# EAGLE design IOT-Tower-Light-Rev-A (EAGLE 7.5.0)
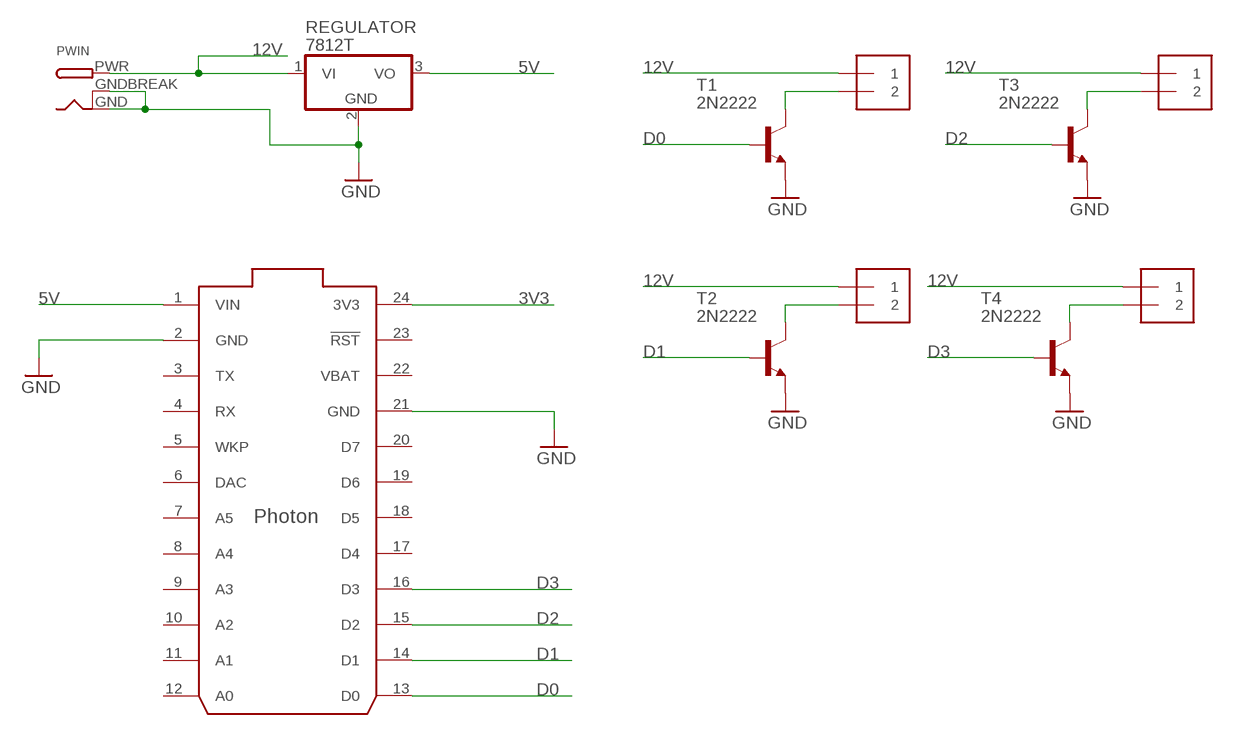
[diagram p0: schematic, sheet 1]

## Parts
BUZZER  1X2-3.5MM  [1X2-3.5MM]
GREEN  1X2-3.5MM  [1X2-3.5MM]
PWIN  DCBARRELPTH  [DCJACK_2MM_PTH]
RED  1X2-3.5MM  [1X2-3.5MM]
REGULATOR  7812T  [TO220H]
T1  2N2222  [TO92-EBC-OVAL]
T2  2N2222  [TO92-EBC-OVAL]
T3  2N2222  [TO92-EBC-OVAL]
T4  2N2222  [TO92-EBC-OVAL]
U$1  PHOTON_WITH_HEADERS  [PHOTON]
YELLOW  1X2-3.5MM  [1X2-3.5MM]

## Nets
3V3: U$1.24(3V3)
5V: REGULATOR.3(VO) U$1.1(VIN)
12V: BUZZER.1 GREEN.1 PWIN.PWR RED.1 REGULATOR.1(VI) YELLOW.1
D0: T1.B U$1.13(D0)
D1: T2.B U$1.14(D1)
D2: T3.B U$1.15(D2)
D3: T4.B U$1.16(D3)
GND: PWIN.GND PWIN.GNDBREAK REGULATOR.2(GND) T1.E T2.E T3.E T4.E U$1.2(GND) U$1.21(GND)
N$1: T2.C YELLOW.2
N$2: RED.2 T1.C
N$3: BUZZER.2 T4.C
N$4: GREEN.2 T3.C
Unconnected: U$1.3(TX) U$1.4(RX) U$1.5(WKP) U$1.6(DAC) U$1.7(A5) U$1.8(A4) U$1.9(A3) U$1.10(A2) U$1.11(A1) U$1.12(A0) U$1.17(D4) U$1.18(D5) U$1.19(D6) U$1.20(D7) U$1.23(!RST)

## Power pins joined to a net without a drawn wire
VBAT: U$1.22(VBAT)

## Library data of the parts
BUZZER GREEN RED YELLOW = adafruit:1X2: 3.5mm Terminal block http://www.ladyada.net/library/pcb/eaglelibrary.html
PWIN = adafruit:DCBARREL: 2.0mm DC Barrel Jack DCJACK_2MM_PTH - Through Hole Jack (4UConnector: 05537)
REGULATOR = adafruit:78*: Positive VOLTAGE REGULATOR Added bigger pads to the TO-92 package
T1-T4 = adafruit:2N2222: NPN TRANSISTOR Big oval pads
U$1 = Spark:PHOTON

## Board
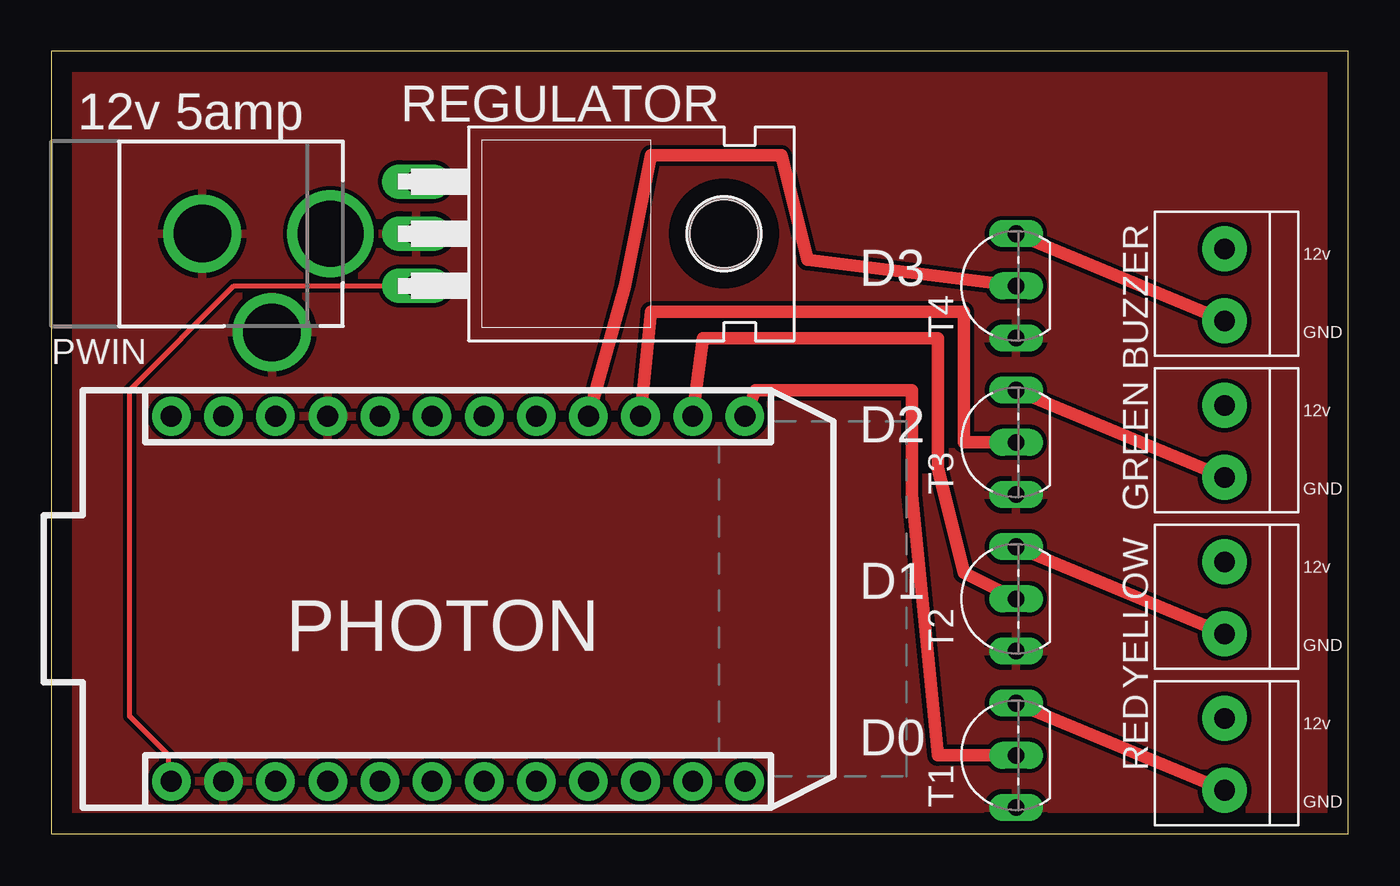
[diagram p1: board, top side]
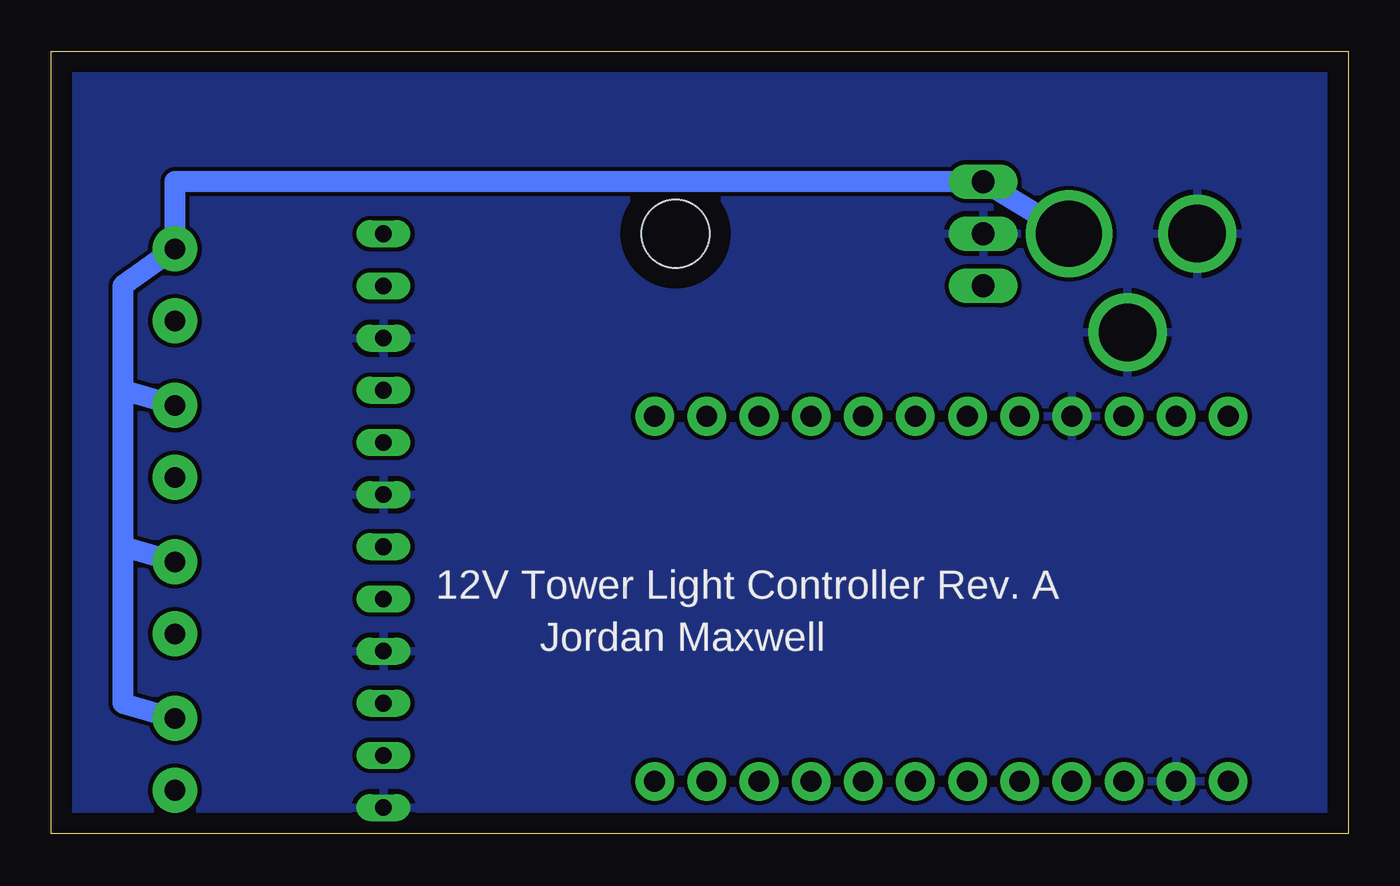
[diagram p2: board, bottom side, seen from below]

Size 63.17 x 38.09 mm. Coordinates in mm from the lower left corner, seen from the top.
Outline: 0,0 63.17,0 63.17,38.09 0,38.09 0,0
Copper layers (1*16): Top 0.035mm / dielectric 1.5mm / Bottom 0.035mm
Design rules "default": minimum track width 10mil, minimum drill 24mil, track to track 8mil, track to pad 8mil, pad to pad 8mil, via to via 8mil, smd to smd 8mil, copper to edge 40mil, drill to drill 8mil, minimum pad ring 10mil, minimum via ring 8mil, stop-mask expansion 4mil, vias tented up to drill 0mil, thermal gap 10mil

### Footprints (pad centres in the part's own frame; a part is rotated, then mirrored left to right if it is on the bottom)
1X2-3.5MM = drill 1 pad 2.184: 1 1.8,0; 2 -1.7,0
DCJACK_2MM_PTH = drill 2.8: GND 0,7.35; GNDBREAK 4.8,10.75 | drill 3.2: PWR 0,13.6
TO220H = drill 1.118 long: 1 -2.54,-10.16; 2 0,-10.16; 3 2.54,-10.16 | hole 3.302: 0,4.826
TO92-EBC-OVAL = drill 0.813 long: B 0,-1.27; C 2.54,-1.27; E -2.54,-1.27
PHOTON = drill 1.016 pad 1.88: 1 1.27,32.258; 2 1.27,29.718; 3 1.27,27.178; 4 1.27,24.638; 5 1.27,22.098; 6 1.27,19.558; 7 1.27,17.018; 8 1.27,14.478; 9 1.27,11.938; 10 1.27,9.398; 11 1.27,6.858; 12 1.27,4.318; 13 19.05,4.318; 14 19.05,6.858; 15 19.05,9.398; 16 19.05,11.938; 17 19.05,14.478; 18 19.05,17.018; 19 19.05,19.558; 20 19.05,22.098; 21 19.05,24.638; 22 19.05,27.178; 23 19.05,29.718; 24 19.05,32.258

### Placement (x,y rotation side)
BUZZER  57.15,26.67 90 top
GREEN  57.15,19.05 90 top
PWIN  0,29.21 270 top
RED  57.15,3.81 90 top
REGULATOR  27.94,29.21 270 top
T1  45.72,3.81 90 top
T2  45.72,11.43 90 top
T3  45.72,19.05 90 top
T4  45.72,26.67 90 top
U$1  38.1,1.27 90 top
YELLOW  57.15,11.43 90 top

### Tracks (layer width: path | path; a pad name or v marks a point on that pad's centre or on a via)
5V
  Top 0.254: REGULATOR.3 8.89,26.67 3.81,21.59 3.81,5.71 5.71,3.81 5.71,2.54 U$1.1
12V
  Bottom 1.016: PWIN.PWR REGULATOR.1 57.15,31.75 BUZZER.1 59.69,26.67 59.69,21.59 | GREEN.1 59.69,21.59 | 59.69,21.59 59.69,13.97 | YELLOW.1 59.69,13.97 | 59.69,13.97 59.69,6.35 RED.1
D0
  Top 0.61: T1.B 43.18,3.81 41.91,16.51 41.91,21.59 34.29,21.59 U$1.13
D1
  Top 0.61: U$1.14 31.75,24.13 43.18,24.13 43.18,17.78 44.45,12.7 T2.B
D2
  Top 0.61: T3.B 44.45,19.05 44.45,25.4 29.21,25.4 U$1.15
D3
  Top 0.61: U$1.16 27.94,26.67 29.21,33.02 35.56,33.02 36.83,27.94 T4.B
GND
  pour Bottom: 0,0 63.5,0 63.5,38.1 0,38.1
  pour Top: 0,0 63.5,0 63.5,38.1 0,38.1
N$1
  Top 0.61: T2.C YELLOW.2
N$2
  Top 0.61: T1.C RED.2
N$3
  Top 0.61: T4.C BUZZER.2
N$4
  Top 0.61: T3.C GREEN.2

### Text on the board
tPlace: 12v 5amp | 12v | D3 | GND | 12v | D2 | GND | 12v | D1 | PHOTON | GND | 12v | D0 | GND
bPlace: 12V Tower Light Controller Rev. A | Jordan Maxwell